# EAGLE design nixie-2-mirr (EAGLE 5.04)
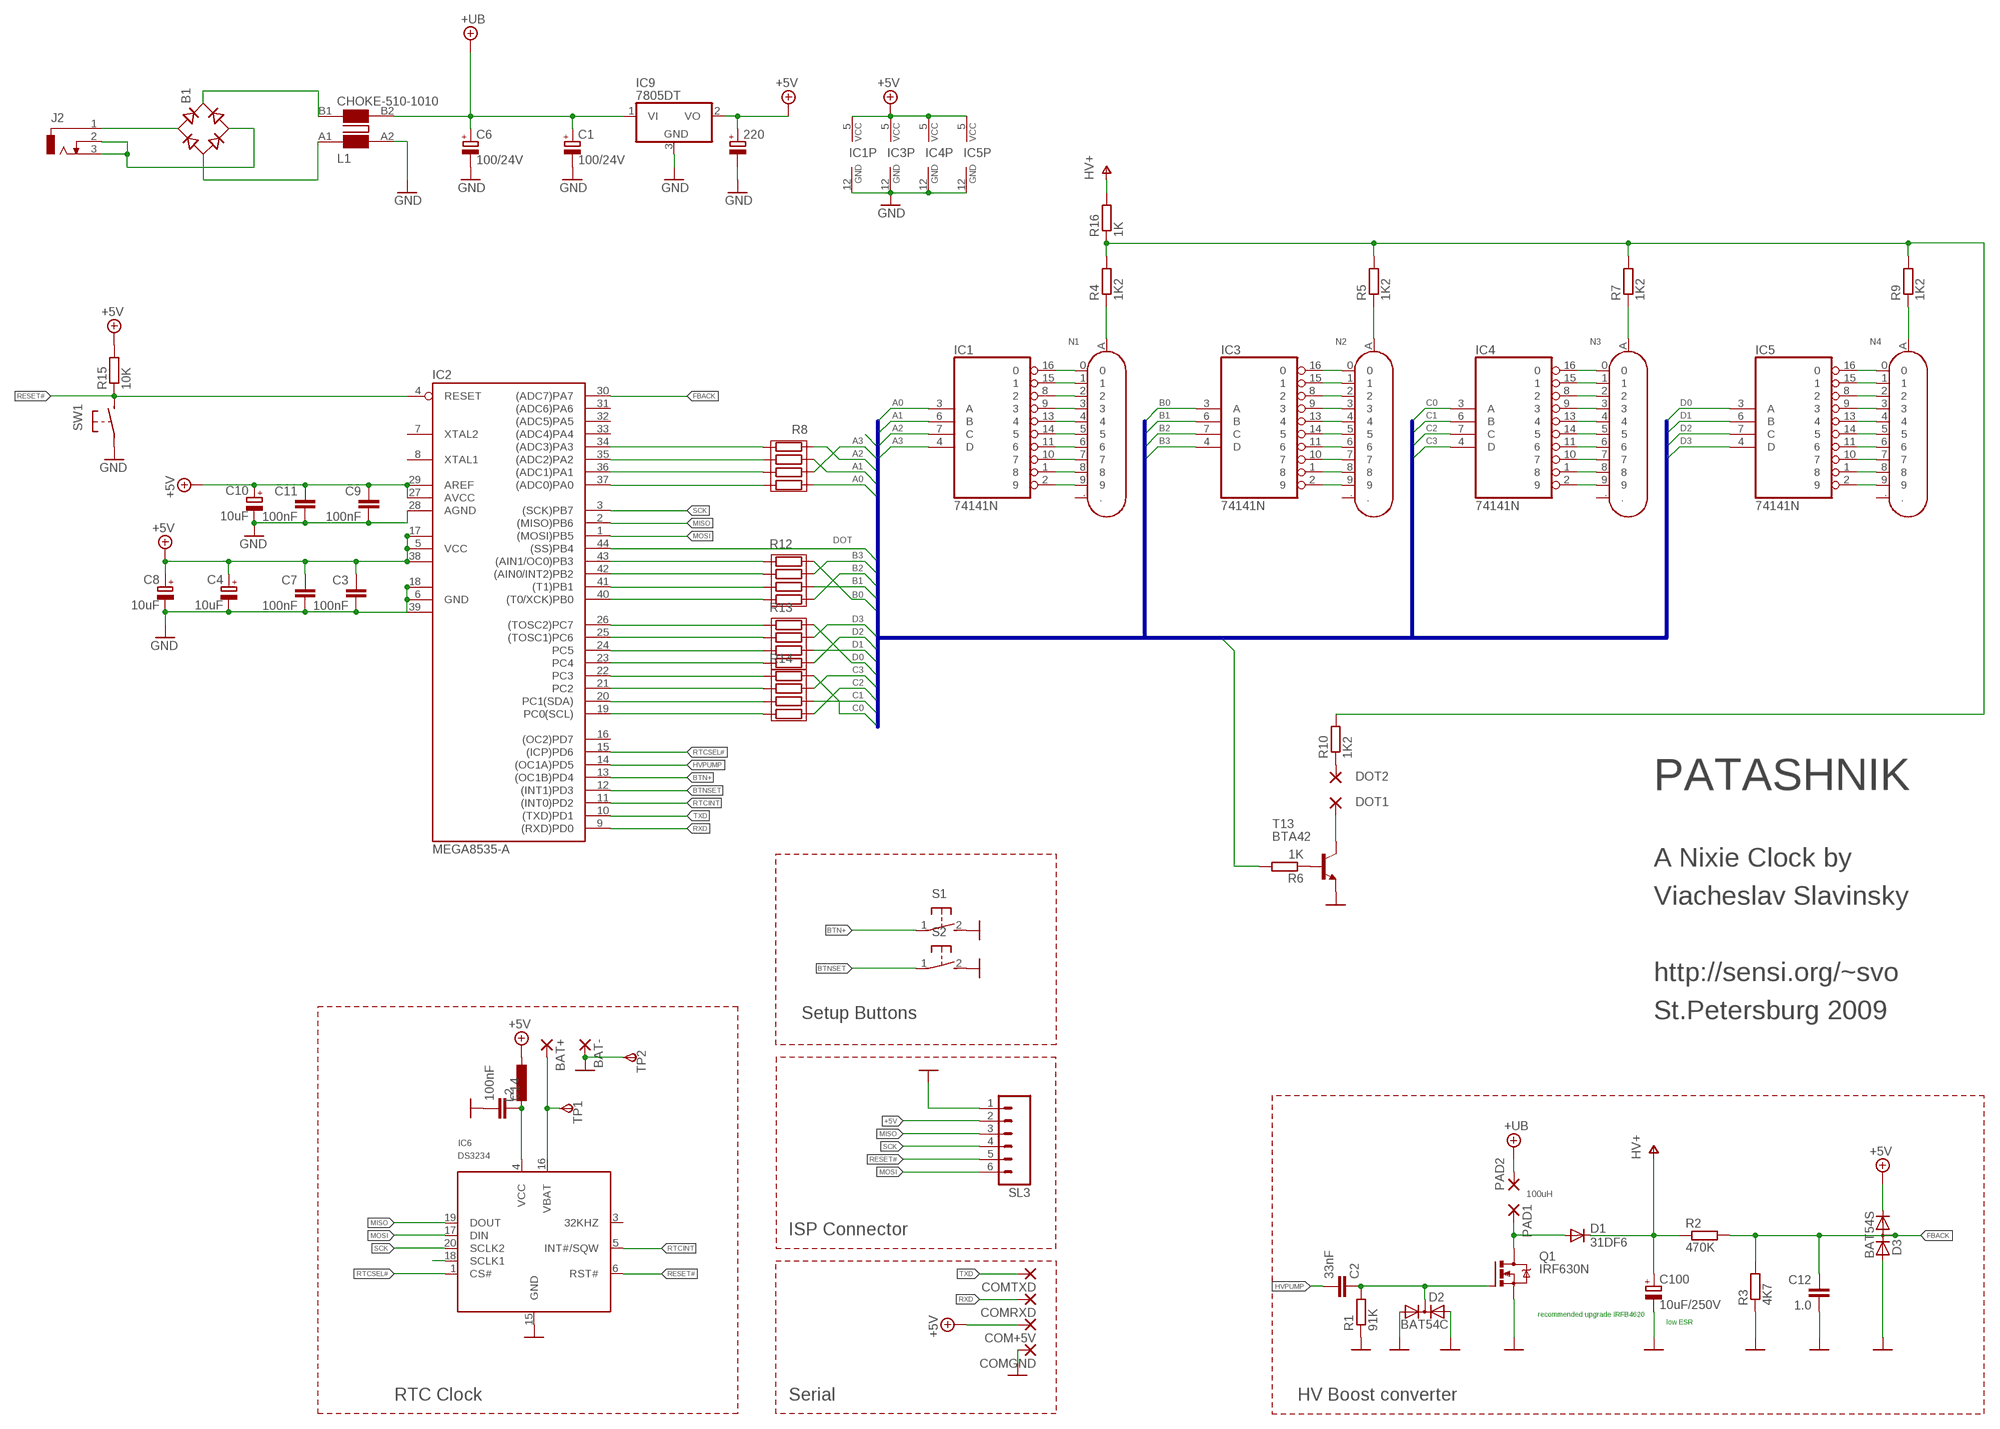
[diagram p0: schematic, sheet 1]

## Parts
220  CPOL-EUD/7343-31R  [D/7343-31R]
B1  B-DIL  [B-DIL]
BAT+  1,6/0,8  [1,6/0,8]
BAT-  1,6/0,8  [1,6/0,8]
C1  100/24V  CPOL-EUE3.5-8  [E3,5-8]
C2  33nF  C-EUC0805K  [C0805K]
C3  100nF  C-EUC0603K  [C0603K]
C4  10uF  CPOL-EUSMCB  [SMC_B]
C6  100/24V  CPOL-EUE3.5-8  [E3,5-8]
C7  100nF  C-EUC0603K  [C0603K]
C8  10uF  CPOL-EUSMCB  [SMC_B]
C9  100nF  C-EUC0603K  [C0603K]
C10  10uF  CPOL-EUSMCB  [SMC_B]
C11  100nF  C-EUC0603K  [C0603K]
C12  1.0  C-EUC0805S  [C0805S]
C14  100nF  C-EUC0603K  [C0603K]
C100  10uF/250V  CPOL-EUE5-13  [E5-13]
COM+5V  1,6/0,8  [1,6/0,8]
COMGND  1,6/0,8  [1,6/0,8]
COMRXD  1,6/0,8  [1,6/0,8]
COMTXD  1,6/0,8  [1,6/0,8]
D1  31DF6  RGP30  [DO201-15]
D2  BAT54C  DIODE-2AC|CASOT23  [SOT23]
D3  BAT54S  DIODE_2CACA-SOT23  [SOT23@1]
DOT1  1,6/0,8  [1,6/0,8]
DOT2  1,6/0,8  [1,6/0,8]
IC1  74141N  [DIL16]
IC2  MEGA8535-A  [TQFP44]
IC3  74141N  [DIL16]
IC4  74141N  [DIL16]
IC5  74141N  [DIL16]
IC6  DS3234  [SO-20DW]
IC9  7805DT  [TO252]
J2  DCJ-SMALL  [DCJ-SMALL]
L1  CHOKE-510-1010  [WE-SL2_74422...]
L2  L-EUL4532C  [L4532M]
N1  IN-8-2  [IN-8]
N2  IN-8-2  [IN-8]
N3  IN-8-2  [IN-8]
N4  IN-8-2  [IN-8]
PAD1  1,6/0,8  [1,6/0,8]
PAD2  1,6/0,8  [1,6/0,8]
Q1  IRF630N  IRF740  [TO220BV]
R1  91K  R-EU_R0805S  [R0805-SVO]
R2  470K  R-EU_R0805S  [R0805-SVO]
R3  4K7  R-EU_R0805S  [R0805-SVO]
R4  1K2  R-EU_R0805S  [R0805-SVO]
R5  1K2  R-EU_R0805S  [R0805-SVO]
R6  1K  R-EU_R0805S  [R0805-SVO]
R7  1K2  R-EU_R0805S  [R0805-SVO]
R8  RES4  [RESSMD-YC16]
R9  1K2  R-EU_R0805S  [R0805-SVO]
R10  1K2  R-EU_R0805S  [R0805-SVO]
R12  RES4  [RESSMD-YC16]
R13  RES4  [RESSMD-YC16]
R14  RES4  [RESSMD-YC16]
R15  10K  R-EU_R0805S  [R0805-SVO]
R16  1K  R-EU_R0805S  [R0805-SVO]
S1  31-XX  [B3F-31XX]
S2  31-XX  [B3F-31XX]
SL3  M06  [06P]
SW1  BUTTON-IT_1181  [SW_IT1181]
T13  BTA42  MMBTA42LT1-NPN-SOT23-BEC  [SOT23-BEC]
TP1  TPSTP20SQ  [TP20SQ]
TP2  TPSTP20SQ  [TP20SQ]

## Nets
+5V: 220.+ C3.1 C4.+ C7.1 C8.+ C9.1 C10.+ C11.1 COM+5V.1(P) D3.2(C) IC1.5(VCC) IC2.5(VCC) IC2.17(VCC1) IC2.27(AVCC) IC2.29(AREF) IC2.38(VCC2) IC3.5(VCC) IC4.5(VCC) IC5.5(VCC) IC9.2(VO) L2.1 R15.2 SL3.2
+UB: C1.+ C6.+ IC9.1(VI) L1.B2 PAD2.1(P)
A0: IC1.3(A) R8.R4$1(4.1)
A1: IC1.6(B) R8.R2$1(2.1)
A2: IC1.7(C) R8.R1$1(1.1)
A3: IC1.4(D) R8.R3$1(3.1)
AN1: N1.A R4.1
AN2: N2.A R5.1
AN3: N3.A R7.1
AN4: N4.A R9.1
B0: IC3.3(A) R12.R1$2(1.2)
B1: IC3.6(B) R12.R3$2(3.2)
B2: IC3.7(C) R12.R4$2(4.2)
B3: IC3.4(D) R12.R2$2(2.2)
BTN+: IC2.13((OC1B)PD4) S1.1(P)
BTNSET: IC2.12((INT1)PD3) S2.1(P)
C0: IC4.3(A) R14.R1$2(1.2)
C1: IC4.6(B) R14.R3$2(3.2)
C2: IC4.7(C) R14.R4$2(4.2)
C3: IC4.4(D) R14.R2$2(2.2)
D0: IC5.3(A) R13.R1$2(1.2)
D1: IC5.6(B) R13.R3$2(3.2)
D2: IC5.7(C) R13.R4$2(4.2)
D3: IC5.4(D) R13.R2$2(2.2)
DOT: IC2.44((SS)PB4) R6.2
FBACK: C12.1 D3.3(AC) IC2.30((ADC7)PA7) R2.2 R3.2
GND: 220.- BAT-.1(P) C1.- C3.2 C4.- C6.- C7.2 C8.- C9.2 C10.- C11.2 C12.2 C14.2 C100.- COMGND.1(P) D2.1(A1) D2.2(A2) D3.1(A) IC1.12(GND) IC2.6(GND) IC2.18(GND1) IC2.28(AGND) IC2.39(GND2) IC3.12(GND) IC4.12(GND) IC5.12(GND) IC6.15(GND) IC9.3(GND) L1.A2 Q1.S R1.1 R3.1 S1.2(S) S2.2(S) SL3.1 SW1.P$1(P1) T13.E TP2.TP(PP)
HV+: C100.+ D1.C R2.1 R16.2
HVBUS: R4.2 R5.2 R7.2 R9.2 R10.2 R16.1
HVPUMP: C2.2 IC2.14((OC1A)PD5)
MISO: IC2.2((MISO)PB6) IC6.19(DOUT) SL3.3
MOSI: IC2.1((MOSI)PB5) IC6.17(DIN) SL3.6
N$1: DOT2.1(P) R10.1
N$2: IC6.18(SCLK1)
N$3: C2.1 D2.3(C) Q1.G R1.2
N$4: IC1.16 N1.0
N$5: IC1.15 N1.1
N$6: IC1.8 N1.2
N$7: D1.A PAD1.1(P) Q1.D
N$8: IC1.9 N1.3
N$9: BAT+.1(P) IC6.16(VBAT) TP1.TP(PP)
N$11: IC1.13 N1.4
N$12: IC1.14 N1.5
N$13: IC1.11 N1.6
N$14: IC1.10 N1.7
N$15: IC1.1 N1.8
N$16: IC1.2 N1.9
N$17: IC3.16 N2.0
N$18: IC3.15 N2.1
N$19: IC3.8 N2.2
N$20: IC3.9 N2.3
N$21: R6.1 T13.B
N$22: IC3.13 N2.4
N$23: IC3.14 N2.5
N$24: IC3.11 N2.6
N$25: B1.+ L1.B1
N$26: IC3.10 N2.7
N$27: IC3.1 N2.8
N$28: IC3.2 N2.9
N$29: IC4.16 N3.0
N$30: IC4.15 N3.1
N$31: IC4.8 N3.2
N$32: IC4.9 N3.3
N$33: B1.- L1.A1
N$34: IC4.13 N3.4
N$35: IC4.14 N3.5
N$36: IC4.11 N3.6
N$37: IC4.10 N3.7
N$38: IC4.1 N3.8
N$39: IC4.2 N3.9
N$40: IC5.16 N4.0
N$41: IC5.15 N4.1
N$42: IC5.8 N4.2
N$44: IC5.9 N4.3
N$45: IC5.13 N4.4
N$46: IC5.14 N4.5
N$47: IC5.11 N4.6
N$48: IC5.10 N4.7
N$49: IC5.1 N4.8
N$50: IC5.2 N4.9
N$51: DOT1.1(P) T13.C
N$53: C14.1 IC6.4(VCC) L2.2
N$56: IC2.43((AIN1/OC0)PB3) R12.R1$1(1.1)
N$63: IC2.42((AIN0/INT2)PB2) R12.R2$1(2.1)
N$64: B1.AC2 J2.2 J2.3
N$65: B1.AC1 J2.1
N$66: IC2.41((T1)PB1) R12.R3$1(3.1)
N$67: IC2.40((T0/XCK)PB0) R12.R4$1(4.1)
N$68: IC2.26((TOSC2)PC7) R13.R1$1(1.1)
N$69: IC2.25((TOSC1)PC6) R13.R2$1(2.1)
N$70: IC2.24(PC5) R13.R3$1(3.1)
N$71: IC2.23(PC4) R13.R4$1(4.1)
N$72: IC2.22(PC3) R14.R1$1(1.1)
N$73: IC2.21(PC2) R14.R2$1(2.1)
N$74: IC2.20(PC1(SDA)) R14.R3$1(3.1)
N$75: IC2.19(PC0(SCL)) R14.R4$1(4.1)
N$76: IC2.34((ADC3)PA3) R8.R1$2(1.2)
N$77: IC2.35((ADC2)PA2) R8.R2$2(2.2)
N$78: IC2.36((ADC1)PA1) R8.R3$2(3.2)
N$79: IC2.37((ADC0)PA0) R8.R4$2(4.2)
RESET#: IC2.4(RESET) IC6.6(RST#) R15.1 SL3.5 SW1.P$2(P2)
RTCINT: IC2.11((INT0)PD2) IC6.5(INT#/SQW)
RTCSEL#: IC2.15((ICP)PD6) IC6.1(CS#)
RXD: COMRXD.1(P) IC2.9((RXD)PD0)
SCK: IC2.3((SCK)PB7) IC6.20(SCLK2) SL3.4
TXD: COMTXD.1(P) IC2.10((TXD)PD1)
Unconnected: IC2.7(XTAL2) IC2.8(XTAL1) IC2.16((OC2)PD7) IC2.31((ADC6)PA6) IC2.32((ADC5)PA5) IC2.33((ADC4)PA4) IC6.3(32KHZ) N1.. N2.. N3.. N4..

## Buses
A[0..3],B[0..3],C[0..3],D[0..3],DOT

## Notes on the sheet
- PATASHNIK
- A Nixie Clock by
- Viacheslav Slavinsky
- http://sensi.org/~svo
- Setup Buttons | St.Petersburg 2009
- 100uH
- ISP Connector
- recommended upgrade IRFB4620
- low ESR
- RTC Clock | Serial | HV Boost converter

## Library data of the parts
220 C1 C4 C6 C8 C10 C100 = rcl:CPOL-EU: POLARIZED CAPACITOR, European symbol
B1 = rectifier:B-DIL: RECTIFIER
BAT+ BAT- COM+5V COMGND COMRXD COMTXD DOT1 DOT2 PAD1 PAD2 = wirepad:1,6/0,8: THROUGH-HOLE PAD
C2 C3 C7 C9 C11 C12 C14 = rcl:C-EU: CAPACITOR, European symbol
D1 = diode:RGP30: DIODE fast-recovery rectifier
D2 = diode:DIODE-2AC|CA: Dual DIODE Anode-Cathode|Cathode-Anode
D3 = diode:DIODE_2CACA-: 2 Diodes - Cathode-Anode|Cathode-Anode
IC1 IC3-IC5 = 74xx-eu:74*141: BCD to decimal DECODER/DRIVER
IC2 = avr:MEGA8535: MICROCONTROLLER 8 Kbytes FLASH 512 bytes SRAM 512 bytes EEPROM USART 8-channel 10 bit ADC
IC6 = 0-ds3234:DS3234*: Extremely Accurate SPI Bus RTC with Integrated Crystal and SRAM The DS3234 is a low-cost, extremely accurate SPI? bus real-time clock (RTC) with an integrated temperature-com- pensated crystal oscillator (TCXO) and crystal. The DS3234 incorporates a precision, temperature-compen- sated voltage reference and comparator circuit to monitor VCC. When VCCdrops below the power-fail voltage (VPF), the device asserts the RSToutput and also disables read and write access to the part when VCCdrops below both VPFand VBAT. The RSTpin is monitored as a pushbutton input for generating a µP reset. The device switches to the backup supply input and maintains accurate timekeeping when main power to the device is interrupted. The integra- tion of the crystal resonator enhances the long-term accu- racy of the device as well as reduces the piece-part count in a manufacturing line. The DS3234 is available in com- mercial and industrial temperature ranges, and is offered in an industry-standard 300-mil, 20-pin SO package. The DS3234 also integrates 256 bytes of battery-backed SRAM. In the event of main power loss, the contents of the memory are maintained by the power source con- nected to the VBATpin. The RTC maintains seconds, minutes, hours, day, date, month, and year information. The date at the end of the month is automatically adjust- ed for months with fewer than 31 days, including correc- tions for leap year. The clock operates in either the 24-hour or 12-hour format with AM/PM indicator. Two programmable time-of-day alarms and a programmable square-wave output are provided. Address and data are transferred serially by an SPI bidirectional bus. Accuracy ±2ppm from 0°C to +40°C Accuracy ±3.5ppm from -40°C to +85°C Battery Backup Input for Continuous Timekeeping Operating Temperature Ranges Commercial: 0°C to +70°C Industrial: -40°C to +85°C Low-Power Consumption Real-Time Clock Counts Seconds, Minutes, Hours, Day, Date, Month, and Year with Leap Year Compensation Valid Up to 2099 Two Time-of-Day Alarms Programmable Square-Wave Output 4MHz SPI Bus Supports Modes 1 and 3 Digital Temp Sensor Output: ±3°C Accuracy Register for Aging Trim RSTInput/Output 300-Mil, 20-Pin SO Package Underwriters Laboratories (UL®) Recognized
IC9 = linear:78*: Positive VOLTAGE REGULATOR Source: http://cache.national.com/ds/LM/LM78L05.pdf http://www.fairchildsemi.com/ds/LM/LM7805.pdf
J2 = 0-svo:DCJ-SMALL: Smaller DC power jack
L1 = 0-svo:CHOKE-510-1010
L2 = rcl:L-EU: INDUCTOR, European symbol
N1-N4 = 0-nixies-russian:IN-8-2: IN-8-2 Nixie Tube
Q1 = transistor-power:IRF740: N-CHANNEL MOS FET
R1-R7 R9 R10 R15 R16 = rcl:R-EU_: RESISTOR, European symbol
R8 R12-R14 = 0-svo:RES4
S1 S2 = switch-omron:31-XX: OMRON SWITCH
SL3 = con-amp-quick:M06: AMP QUICK CONNECTOR
SW1 = 0-svo:BUTTON-IT_1181
T13 = transistor:*-NPN-: NPN Transistror
TP1 TP2 = 0-svo:TPS: TEST PIN

## Board
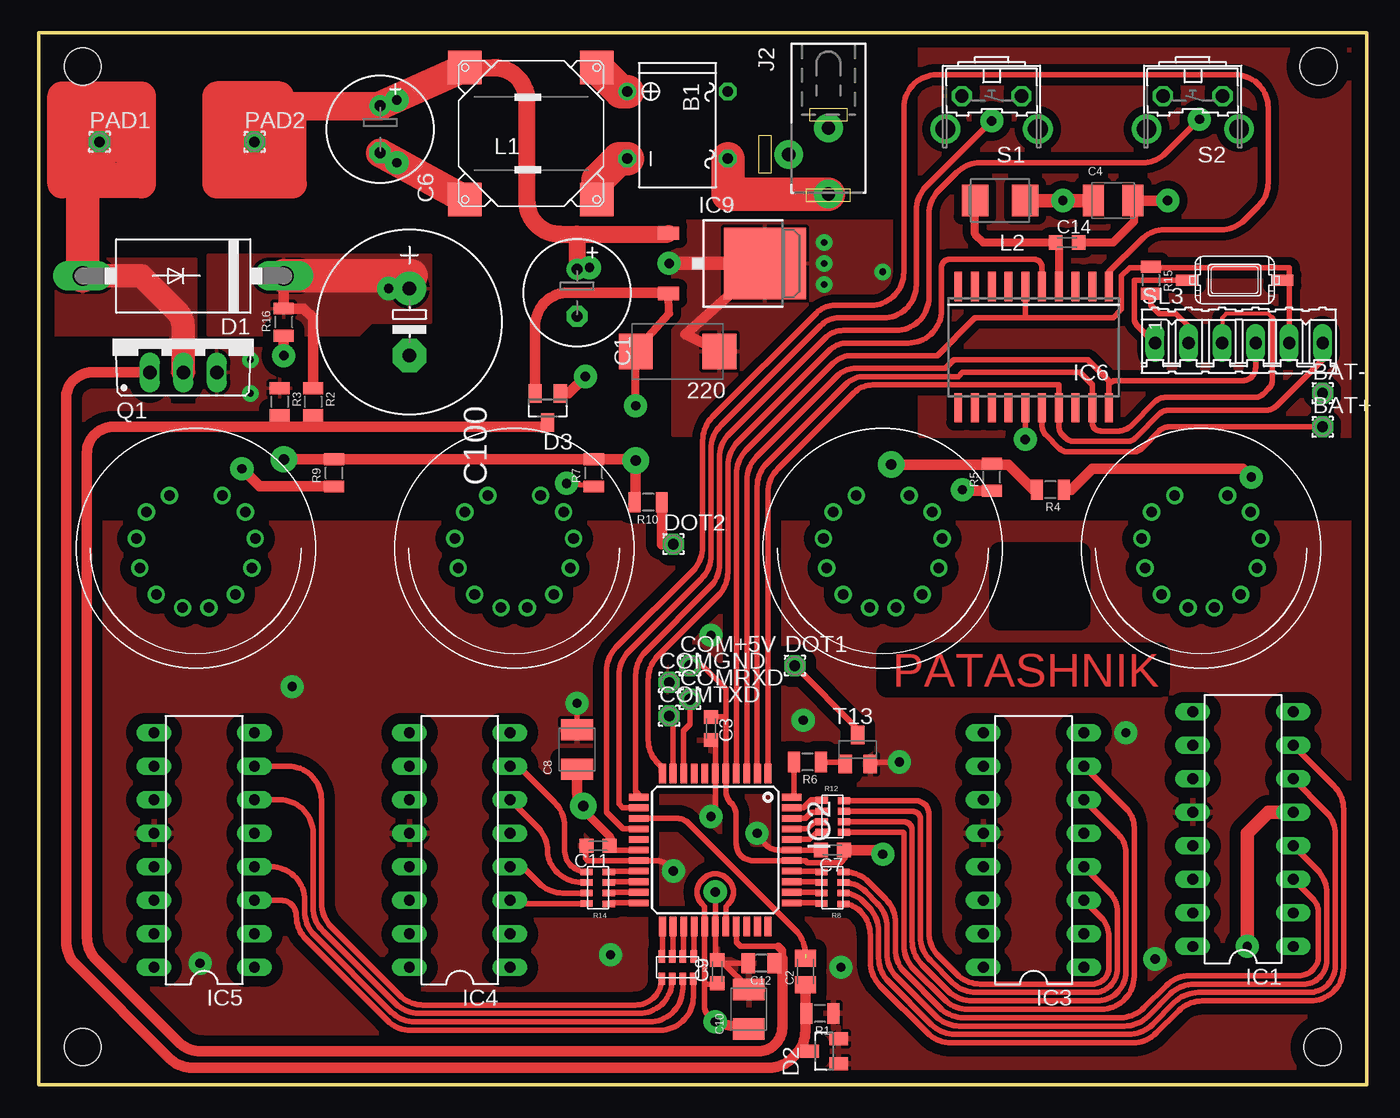
[diagram p1: board, top side]
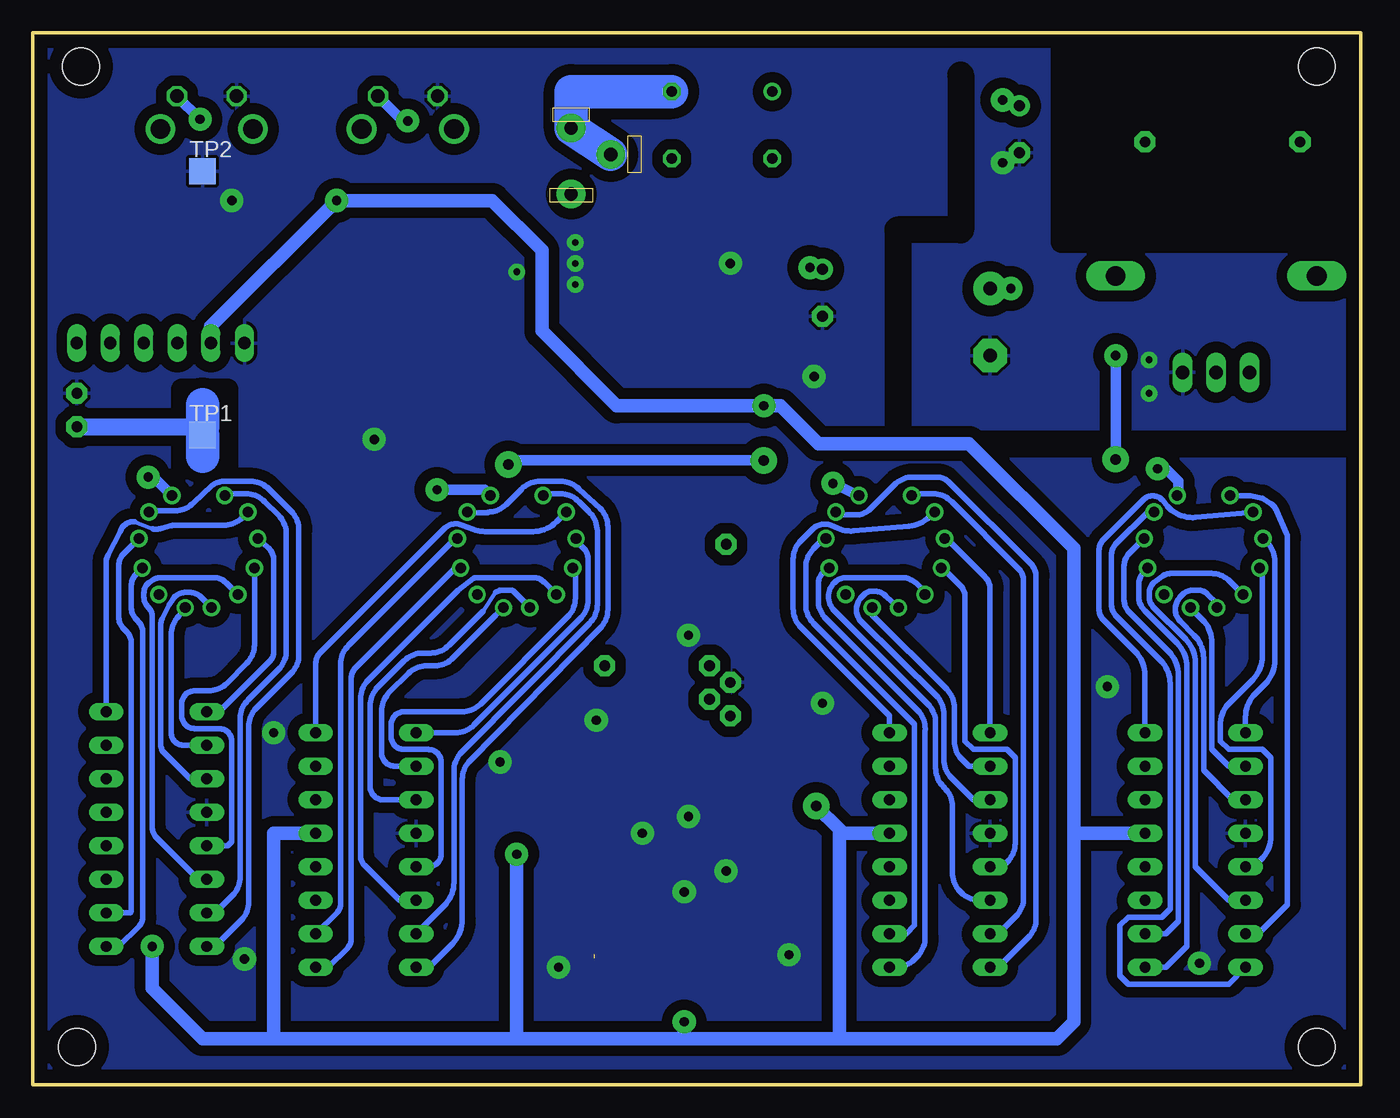
[diagram p2: board, bottom side, seen from below]

Size 100.64 x 79.68 mm. Coordinates in mm from the lower left corner, seen from the top.
Outline: 0,0 100.64,0 100.64,79.68 0,79.68 0,0
Copper layers (1*16): Top 0.035mm / dielectric 1.5mm / Bottom 0.035mm
Design rules "default": minimum track width 10mil, minimum drill 24mil, track to track 10mil, track to pad 10mil, pad to pad 8mil, via to via 8mil, smd to smd 8mil, copper to edge 40mil, drill to drill 8mil, minimum pad ring 10mil, minimum via ring 8mil, stop-mask expansion 4mil, vias tented up to drill 0mil, thermal gap 10mil
Holes 2.8 mm at 3.33,2.85 3.33,77.15 96.99,77.15 97.31,2.85
tRestrict: area 5.6,65.1 to 18.6,78.1; area 72.9,35.2 to 78.9,40.3; area 64.3,30.2 to 84.6,32.7
bRestrict: area 0.2,63.8 to 22.7,79.4; area 85.9,46.7 to 89.4,52.7; 4 lines

### Footprints (pad centres in the part's own frame; a part is rotated, then mirrored left to right if it is on the bottom)
D/7343-31R = smd 2.55 x 2.7: + 3.175,0; - -3.175,0
B-DIL = drill 0.813 round: + -2.54,-3.81 | drill 0.813 octagon: - 2.54,-3.81; AC1 2.54,3.81; AC2 -2.54,3.81
1,6/0,8 = drill 0.813 pad 1.6 octagon: 1 0,0
E3,5-8 = drill 0.813 pad 1.6 round: + -1.778,0 | drill 0.813 pad 1.6 octagon: - 1.778,0
C0805K = smd 1.3 x 1.6: 1 -1,0; 2 1,0
C0603K = smd 1.05 x 1.08: 1 -0.875,0; 2 0.875,0
SMC_B = smd 1.6 x 2.4: + -1.5,0; - 1.5,0
C0805S = smd 1.016 x 1.524: 1 -0.977,0; 2 0.977,0
E5-13 = drill 1.016 pad 2.54 round: + -2.54,0 | drill 1.016 pad 2.54 octagon: - 2.54,0
DO201-15 = drill 1.499 long: A 7.62,0; C -7.62,0
SOT23 = smd 1 x 1.4: 1 -0.95,-1.1; 2 0.95,-1.1; 3 0,1.1
SOT23@1 = smd 1 x 1.4: 1 -0.95,-1.1; 2 0.95,-1.1; 3 0,1.1
DIL16 = drill 0.813 long: 1 -8.89,-3.81; 2 -6.35,-3.81; 3 -3.81,-3.81; 4 -1.27,-3.81; 5 1.27,-3.81; 6 3.81,-3.81; 7 6.35,-3.81; 8 8.89,-3.81; 9 8.89,3.81; 10 6.35,3.81; 11 3.81,3.81; 12 1.27,3.81; 13 -1.27,3.81; 14 -3.81,3.81; 15 -6.35,3.81; 16 -8.89,3.81
TQFP44 = smd 1.5 x 0.5: 1 -5.8,4; 2 -5.8,3.2; 3 -5.8,2.4; 4 -5.8,1.6; 5 -5.8,0.8; 6 -5.8,0; 7 -5.8,-0.8; 8 -5.8,-1.6; 9 -5.8,-2.4; 10 -5.8,-3.2; 11 -5.8,-4; 23 5.8,-4; 24 5.8,-3.2; 25 5.8,-2.4; 26 5.8,-1.6; 27 5.8,-0.8; 28 5.8,0; 29 5.8,0.8; 30 5.8,1.6; 31 5.8,2.4; 32 5.8,3.2; 33 5.8,4 | smd 0.5 x 1.5: 12 -4,-5.8; 13 -3.2,-5.8; 14 -2.4,-5.8; 15 -1.6,-5.8; 16 -0.8,-5.8; 17 0,-5.8; 18 0.8,-5.8; 19 1.6,-5.8; 20 2.4,-5.8; 21 3.2,-5.8; 22 4,-5.8; 34 4,5.8; 35 3.2,5.8; 36 2.4,5.8; 37 1.6,5.8; 38 0.8,5.8; 39 0,5.8; 40 -0.8,5.8; 41 -1.6,5.8; 42 -2.4,5.8; 43 -3.2,5.8; 44 -4,5.8
SO-20DW = smd 0.6 x 2.2: 1 -5.715,-4.6; 2 -4.445,-4.6; 3 -3.175,-4.6; 4 -1.905,-4.6; 5 -0.635,-4.6; 6 0.635,-4.6; 7 1.905,-4.6; 8 3.175,-4.6; 9 4.445,-4.6; 10 5.715,-4.6; 11 5.715,4.6; 12 4.445,4.6; 13 3.175,4.6; 14 1.905,4.6; 15 0.635,4.6; 16 -0.635,4.6; 17 -1.905,4.6; 18 -3.175,4.6; 19 -4.445,4.6; 20 -5.715,4.6
TO252 = smd 1 x 1.6: 1 -2.28,-4.8; 2 2.28,-4.8 | smd 5.4 x 6.2: 3 0,2.5
DCJ-SMALL = drill 1 pad 2.184 round: 1 0,3; 2 3,0; 3 0,-2
WE-SL2_74422... = smd 2.54 x 2.54: A1 -5,5; A2 5,5; B1 -5,-5; B2 5,-5
L4532M = smd 2 x 2.4: 1 -1.9,0; 2 1.9,0
IN-8 = drill 0.8 round: 0 -3.75,-2.75; 1 2,-4; 2 3.75,-2.75; 3 4.5,-0.75; 4 4.25,1.5; 5 3,3.5; 6 1,4.5; 7 -1,4.5; 8 -4.25,1.5; 9 -4.5,-0.75; . -3,3.5; A -2,-4
TO220BV = drill 1.016 long: D 0,-2.54; G -2.54,-2.54; S 2.54,-2.54
R0805-SVO = smd 0.9 x 1.524: 1 -1.027,0; 2 1.027,0
RESSMD-YC16 = smd 0.508 x 0.914: R1$1 -1.23,-0.821; R1$2 -1.2,0.851; R2$1 -0.4,-0.821; R2$2 -0.4,0.851; R3$1 0.4,-0.821; R3$2 0.4,0.851; R4$1 1.2,-0.821; R4$2 1.2,0.851
B3F-31XX = drill 1.016 octagon: 1 -2.261,-1.245; 2 2.261,-1.245 | drill 1.499 pad 2.159 round: 3 -3.505,1.245; 4 3.505,1.245
06P = drill 0.914 long: 1 -6.35,0; 2 -3.81,0; 3 -1.27,0; 4 1.27,0; 5 3.81,0; 6 6.35,0
SW_IT1181 = smd 1.676 x 0.813: P$1 -3.61,0; P$2 3.61,0
SOT23-BEC = smd 1 x 1.4: B -0.95,-1.1; C 0,1.1; E 0.95,-1.1
TP20SQ = smd 2 x 2: TP 0,0

### Placement (x,y rotation side)
220  48.41,55.56 180 top
B1  48.41,72.7 270 top
BAT+  97.31,49.84 0 top
BAT-  97.31,52.38 0 top
C1  40.79,60 270 top
C2  58.1,8.57 90 top
C3  50.95,26.98 270 top
C4  81.43,66.99 0 top
C6  25.87,72.39 270 top
C7  60.16,17.78 180 top
C8  40.79,25.39 90 top
C9  51.43,8.57 90 top
C10  53.81,5.71 90 top
C11  42.38,18.09 180 top
C12  54.76,9.2 180 top
C14  77.94,63.81 0 top
C100  28.09,57.78 270 top
COM+5V  49.37,31.75 0 top
COMGND  47.78,30.48 0 top
COMRXD  49.37,29.21 0 top
COMTXD  47.78,27.94 0 top
D1  10.95,61.27 180 top
D2  59.52,2.54 90 top
D3  38.57,51.27 180 top
DOT1  57.3,31.75 0 top
DOT2  48.09,40.95 0 top
IC1  91.28,19.36 90 top
IC2  51.27,17.78 270 top
IC3  75.4,17.78 90 top
IC4  31.9,17.78 90 top
IC5  12.54,17.78 90 top
IC6  75.4,55.88 180 top
IC9  52.54,62.23 270 top
J2  59.84,70.48 180 top
L1  37.3,72.07 180 top
L2  72.86,66.99 180 top
N1  88.1,40.63 180 top
N2  63.97,40.63 180 top
N3  36.03,40.63 180 top
N4  11.9,40.63 180 top
PAD1  4.6,71.43 0 top
PAD2  16.34,71.43 0 top
Q1  10.95,56.51 0 top
R1  59.21,5.39 180 top
R2  20.79,51.75 270 top
R3  18.25,51.75 270 top
R4  76.67,45.08 180 top
R5  72.22,46.03 90 top
R6  58.25,24.44 180 top
R7  42.06,46.35 90 top
R8  60.16,14.92 90 top
R9  22.38,46.35 90 top
R10  46.19,44.13 180 top
R12  60.16,20.32 270 top
R13  48.41,8.88 180 top
R14  42.38,14.92 90 top
R15  84.29,60.95 270 top
R16  18.57,57.78 90 top
S1  72.22,73.66 180 top
S2  87.47,73.66 180 top
SL3  90.96,56.19 0 top
SW1  90.64,60.95 0 top
T13  62.06,25.39 0 top
TP1  87.78,49.21 0 bottom
TP2  87.78,69.21 0 bottom

### Tracks (layer width: path | path; a pad name or v marks a point on that pad's centre or on a via)
+5V  (via drill 0.7, 0.8)
  Top 0.406: R15.2 84.29,59.05 84.92,58.41 86.19,58.41 87.15,57.46 SL3.2 | 51.35,7.69 C9.1 51.35,7.61 50.63,7.61 50.47,7.77 | 52.07,27.94 IC2.5 52.07,22.26 arc45 52.44,21.37 52.49,21.32 arc-45 52.86,20.42 52.86,18.25 arc90 54.13,16.98 IC2.38 | 52.07,27.94 52.07,29.99 50.32,31.75 COM+5V.1 | C3.1 51.99,27.86 52.07,27.94 | IC2.38 | 50.47,7.77 IC2.27 50.47,13.5 50.26,13.7 arc-90 50.26,15.5 50.37,15.61 arc-90 52.17,15.61 52.28,15.5 arc-90 52.28,13.7 52.07,13.5 IC2.29 | IC2.38 58.1,16.98 58.25,16.82 60.8,16.82 61.11,17.14 61.11,17.7 C7.1 | 51.34,4.69 v51.27,4.76 50.66,5.37 arc-45 50.47,5.82 50.47,7.77 | IC2.17 43.57,17.78 C11.1 | v41.27,21.11
  Top 0.61: v45.24,51.43 220.+ 47.78,58.41 IC9.2 | v41.27,21.11 41.27,20.79 43.33,18.73 43.33,18.17 C11.1
  Top 0.813: v41.27,21.11 arc-45 40.79,22.26 C8.+ | 51.34,4.69 C10.+ | IC9.2 47.68,60 40.12,60 arc90 37.62,57.5 D3.2 | C7.1 63.97,17.78 v63.97,17.46
  Top 1.016: v91.59,10.47 91.59,19.05 93.18,20.63 IC1.5 | C4.+ v77.62,66.99 L2.1
  Bottom 0.406: 39.52,19.36
  Bottom 1.016: 39.52,19.05 IC4.5 | 39.52,3.49 39.52,19.05 | v91.59,10.47 91.59,7.3 87.78,3.49 82.39,3.49 | 21.74,19.05 IC5.5 | 39.52,3.49 23.01,3.49 21.74,4.76 21.74,19.05 | 21.74,19.05 21.74,40.63 29.68,48.57 41.11,48.57 43.97,51.43 v45.24,51.43 56.39,51.43 62.06,57.11 62.06,63.22 65.83,66.99 v77.62,66.99 87.15,57.46 SL3.2 | 39.52,19.05 39.52,19.36 v41.27,21.11 | 63.97,3.49 v63.97,17.46 | 63.97,3.49 82.39,3.49 | 82.39,3.49 82.39,19.05 IC3.5 | 39.52,3.49 51.27,3.49 | 51.27,3.49 v51.27,4.76 | 51.27,3.49 63.97,3.49
+UB  (via drill 0.7)
  Top 0.61: C6.+ v27.14,74.61
  Top 0.8: C1.+ v41.74,61.91
  Top 0.813: C6.+ 26.19,74.61
  Top 1.27: L1.B2 34.48,77.07 arc-90 36.98,74.57 36.98,66.95 arc90 39.48,64.45 40.79,64.45 | 40.79,64.45 47.68,64.45 IC9.1 | 18.25,69.21 15.08,69.21 15.08,73.97 16.34,74.29 | 40.79,64.45 C1.+
  Top 2.184: 18.25,69.21 18.25,74.92 13.49,74.92 13.49,68.26 19.2,68.26 19.2,74.13 C6.+ L1.B2 | 16.34,74.29 PAD2.1 16.34,69.53
A0
  Top 0.406: R8.R4$1 61.08,16.12 arc-45 62.88,15.37 64.18,14.07 arc-45 64.92,12.28 64.92,10.26 arc45 65.67,8.46 68.31,5.82 arc45 70.1,5.08 81.97,5.08 arc45 83.76,5.82 85.45,7.51 arc-45 87.25,8.25 95.49,8.25 arc90 96.99,9.75 96.99,13.03 arc45 96.55,14.09 IC1.3
A1
  Top 0.406: R8.R2$1 arc-45 62.43,13.92 62.91,13.44 arc-45 63.65,11.64 63.65,9.62 arc45 64.4,7.82 67.67,4.55 arc45 69.47,3.8 82.6,3.8 arc45 84.4,4.55 86.09,6.24 arc-45 87.88,6.98 96.26,6.98 arc90 98.26,8.98 98.26,18.96 arc45 97.53,20.73 IC1.6
A2
  Top 0.406: R8.R1$1 arc-45 62.22,13.17 62.27,13.12 arc-45 63.02,11.33 63.02,9.3 arc45 63.76,7.51 67.35,3.91 arc45 69.15,3.17 82.92,3.17 arc45 84.72,3.91 86.4,5.6 arc-45 88.2,6.34 96.36,6.34 arc90 98.89,8.88 98.89,20.87 arc45 98.16,22.64 IC1.7
A3
  Top 0.406: R8.R3$1 arc-45 62.69,14.61 63.54,13.76 arc-45 64.29,11.96 64.29,9.94 arc45 65.03,8.14 67.99,5.18 arc45 69.78,4.44 82.28,4.44 arc45 84.08,5.18 85.77,6.87 arc-45 87.56,7.61 95.83,7.61 arc90 97.62,9.42 97.62,14.52 arc45 96.89,16.29 IC1.4
AN1  (via drill 0.7)
  Top 0.8: R4.1 78.26,45.08 79.84,46.67 91.28,46.67 v91.91,46.03
  Bottom 0.8: v91.91,46.03 91.5,46.03 N1.A
AN2  (via drill 0.7)
  Top 0.8: R5.1 70.08,45.01 v70,45.08
  Bottom 0.8: v70,45.08 66.41,45.08 N2.A
AN3  (via drill 0.7)
  Top 0.406: v40,45.56 R7.1
  Bottom 0.8: N3.A v40,45.56
AN4  (via drill 0.7)
  Top 0.8: R9.1 16.74,45.32 v15.39,46.67
  Bottom 0.8: v15.39,46.67 14.76,46.67 13.81,45.72 13.81,44.73 N4.A
B0
  Top 0.406: R12.R1$2 66.46,21.52 arc-90 67.46,20.52 67.46,11.53 arc45 68.21,9.73 69.58,8.36 arc45 71.37,7.61 79.84,7.61 arc90 81.11,8.88 81.11,11.23 arc45 80.53,12.65 IC3.3
B1
  Top 0.406: R12.R3$2 65.56,19.91 arc-90 66.19,19.28 66.19,10.89 arc45 66.94,9.09 68.94,7.09 arc45 70.74,6.34 80.19,6.34 arc90 82.39,8.54 82.39,17.58 arc45 81.8,19 IC3.6
B2
  Top 0.406: R12.R4$2 65.49,19.12 65.56,19.05 65.56,10.57 arc45 66.3,8.78 68.62,6.45 arc45 70.42,5.71 80.52,5.71 arc90 83.02,8.21 83.02,19.49 arc45 82.43,20.9 IC3.7
B3
  Top 0.406: R12.R2$2 66.19,20.71 arc-90 66.83,20.08 66.83,11.21 arc45 67.57,9.41 69.26,7.72 arc45 71.05,6.98 79.95,6.98 arc90 81.75,8.78 81.75,13.14 arc45 81.16,14.55 IC3.4
BTN+  (via drill 0.7)
  Top 0.406: IC2.13 44.26,20.98 43.97,21.27 43.97,31.01 arc-45 44.71,32.81 50.21,38.3 arc45 50.95,40.1 50.95,48.16 arc-45 51.7,49.95 59.26,57.51 arc-45 60.67,58.1 64.01,58.1 arc90 66.51,60.6 66.51,66.27 arc-45 67.24,68.04 v72.22,73.02
  Bottom 0.8: v72.22,73.02 72.61,73.02 S1.1
BTNSET  (via drill 0.7)
  Top 0.406: IC2.12 45.47,21.99 45.24,22.22 45.24,31.01 arc-45 45.98,32.81 50.84,37.67 arc45 51.59,39.47 51.59,47.52 arc-45 52.33,49.32 59.57,56.56 arc-45 60.99,57.15 64.96,57.15 arc90 67.46,59.65 67.46,65.95 arc-45 68.19,67.72 69.59,69.11 arc-45 71.36,69.84 83.64,69.84 arc45 85.4,70.58 v87.97,73.15
  Bottom 0.8: v87.97,73.15 S2.1
C0
  Top 0.406: R14.R1$2 35.96,13.72 IC4.3
C1
  Top 0.406: R14.R3$2 41.13,15.32 arc-45 39.33,16.06 39.17,16.22 arc-45 38.57,17.68 arc45 37.83,19.47 IC4.6
C2
  Top 0.406: R14.R4$2 arc-90 39.84,17.81 39.84,19.58 arc45 39.1,21.38 36.35,24.12 IC4.7
C3
  Top 0.406: R14.R2$2 39.7,14.52 arc-45 37.91,15.26 36.66,16.5 IC4.4
D0
  Top 0.406: IC5.3 18.35,13.96 arc-90 19.52,12.79 arc45 20.26,11 26.4,4.87 arc45 28.19,4.12 47.07,4.12 arc90 49.61,6.66 R13.R1$2
D1
  Top 0.406: R13.R3$2 48.01,7.93 arc-90 45.47,5.39 28.83,5.39 arc-45 27.03,6.14 21.53,11.63 arc-45 20.79,13.43 20.79,19.05 arc90 18.25,21.59 IC5.6
D2
  Top 0.406: IC5.7 18.88,24.12 arc-90 21.42,21.59 21.42,13.75 arc45 22.17,11.95 27.35,6.77 arc45 29.14,6.03 45.21,6.03 arc90 R13.R4$2
D3
  Top 0.406: R13.R2$2 48.81,7.3 arc-90 46.27,4.76 28.51,4.76 arc-45 26.71,5.5 20.9,11.32 arc-45 20.15,13.11 20.15,13.96 arc90 17.61,16.5 IC5.4
DOT
  Top 0.406: R6.2 57.23,21.93 IC2.44
FBACK
  Top 0.406: IC2.30 52.87,10.78 53.17,10.47 56.03,10.47 | C12.1 56.03,9.2 56.35,9.52
  Top 0.61: 56.03,10.47 56.35,10.16 56.35,9.52
  Top 0.8: 20.79,49.84 R2.2 | R3.2 18.25,50.16 17.93,49.84 | 28.73,49.84 38.09,49.84 38.17,49.77
  Top 0.813: 56.35,9.52 56.35,4.33 arc-90 54.55,2.54 12.3,2.54 arc-45 10.53,3.27 4.38,9.42 arc-45 3.64,11.19 3.64,47.84 arc-90 5.64,49.84 17.93,49.84 20.79,49.84 28.73,49.84 | 38.17,49.77 D3.3
GND  (via drill 0.5, 0.7)
  Top 0.406: SW1.P$1 83.02,60.95 83.02,58.04 arc45 83.21,57.59 SL3.1 | C7.2 IC2.39 56.03,17.78 arc-53 55.02,18.28 v54.45,19.05 | 41.43,17.7 C11.2 41.43,18.02 41.43,17.14 41.59,16.98 IC2.18 46.78,16.98 arc-45 47.68,16.6 v48.09,16.19 | v51.27,14.6 IC2.28 51.27,9.6 C9.2 51.67,9.2 51.91,9.2 | v65.24,24.44 63.16,24.44 T13.E | C3.2 51.27,25.79 IC2.6 51.27,20.63 v50.95,20.32 | C8.- v40.79,28.89 | v74.77,48.89 IC6.15 | C12.2 51.91,9.2 | C10.- 53.81,7.3 51.91,9.2 | 83.02,66.9 C4.-
  Top 0.61: C14.2 81.43,63.81 83.02,65.4 83.02,66.9
  Top 0.8: D3.1 40.15,52.37 v41.43,53.65
  Top 0.813: IC9.3 49.01,56.87 220.- | C4.- v85.56,66.99
  Top 1.016: IC9.3 v47.78,62.23
  Top 2.184: L1.A2 C6.-
  other vias: 27.14,69.84 59.52,63.81 59.52,60.64 59.52,62.23 63.97,61.59 16.03,54.92 16.03,52.38 19.2,30.16 43.33,9.84 60.8,8.88 57.94,27.62 50.95,34.05 82.39,26.66 84.61,9.52 12.22,9.2
  pour Bottom (isolate 0.813, rank 2): -0.8,80.32 -0.8,-0.01 100.8,-0.01 100.8,80.32
  pour Top (isolate 0.61): 48.09,65.4 65.24,65.4 65.24,58.41 50,49.21 48.09,49.21
  pour Top (isolate 0.813, rank 2): 1.1,61.27 1.1,49.84 21.42,49.84 21.42,61.27
  pour Top (isolate 0.813, rank 2): -0.17,42.54 100.48,42.54 100.48,-0.64 -0.17,-0.64
HV+  (via drill 0.7)
  Top 0.8: R16.2 20.08,58.81 20.79,58.1 R2.1
  Top 0.813: R16.2 D1.C
  Top 1.422: 28.2,61.27 28.41,61.06 28.41,60.64 C100.+ v26.5,60.32
  Top 2.54: D1.C 28.2,61.27
  pour Top (isolate 0.813): 12.85,62.54 12.85,56.83 24.28,56.83 25.23,57.78 29.68,57.78 29.68,62.86 12.85,62.86
HVBUS  (via drill 0.7, 0.8)
  Top 0.254: 23.01,47.38 R9.2
  Top 0.8: 70.25,46.98 72.15,46.98 R5.2 72.3,46.98 73.5,46.98 75.4,45.08 R4.2
  Top 0.813: v18.57,55.24 R16.1 | v18.57,47.38 23.01,47.38 R7.2 45.87,47.38 45.87,47.3 v45.24,47.3 45.24,44.13 R10.2 | v64.61,46.98 70.25,46.98
  Bottom 0.61: 64.29,47.3 v64.61,46.98
  Bottom 0.813: v18.57,47.38 v18.57,55.24 | v45.24,47.3 64.29,47.3
HVPUMP  (1 unrouted)
  Top 0.406: IC2.14 48.34,20.18 arc-45 49.24,19.8 57.35,11.69 arc-45 58.1,9.9
MISO
  Top 0.305: SL3.3 89.69,58.1 90,58.41 93.18,58.41 93.5,58.1
  Top 0.406: IC2.2 54.45,23.6 54.45,45.3 arc-45 55.19,47.09 61.16,53.07 arc-45 62.58,53.65 69.69,53.65 70,53.97 78.89,53.97 79.84,53.02 IC6.19 79.84,50.16 arc90 80.48,49.52 81.86,49.52 arc45 82.76,49.9 84.63,51.77 arc-45 85.34,52.06 92.13,52.06 arc45 92.84,52.36 93.2,52.73 arc45 93.5,53.43 93.5,58.1
MOSI
  Top 0.305: 97.31,54.92 SL3.6
  Top 0.406: 97.31,54.92 93.79,51.41 arc-45 93.08,51.11 85.66,51.11 arc45 84.95,50.82 83.15,49.02 arc-45 82.45,48.73 78.51,48.73 arc-45 77.81,49.02 77.6,49.23 arc-45 77.3,49.94 IC6.17 77.3,53.02 63.21,53.02 arc45 61.8,52.43 56.01,46.65 arc45 55.27,44.85 IC2.1
N$1
  Top 0.813: DOT2.1 47.22,40.95 R10.1
N$3
  Top 0.8: 4.06,53.97 Q1.G | 58.1,4.05 58.1,5.08 | 58.1,5.08 C2.1 | R1.2 58.18,5.16 58.1,5.08 | D2.3 57.62,2.54 57.36,2.28
  Top 0.813: 4.06,53.97 arc90 2.06,51.97 2.06,10.87 arc45 2.79,9.11 9.9,2 arc45 11.67,1.26 55.31,1.26 arc45 57.08,2 57.36,2.28 arc45 58.1,4.05
N$4
  Bottom 0.406: IC1.16 86.83,10.47 84.88,12.43 arc-45 84.29,13.84 84.29,27.11 arc45 83.7,28.52 81.07,31.16 arc-45 80.48,32.57 80.48,42.03 arc-45 81.07,43.44 82.75,45.13 arc-45 84.17,45.72 85.84,45.72 arc-45 87.1,45.37 88.47,44.08 arc45 89.88,43.49 91.74,43.49 N1.0
N$5
  Bottom 0.406: N1.1 85.97,44.76 84.48,44.76 arc45 83.07,44.18 82.02,43.13 arc45 81.43,41.71 81.43,32.89 arc45 82.02,31.48 84.34,29.16 arc-45 84.92,27.74 84.92,15.75 arc45 85.51,14.33 86.83,13.01 IC1.15
N$6
  Bottom 0.305: 92.94,42.65 91.56,42.12
  Bottom 0.406: N1.2 84.77,42.97 arc45 86.18,42.38 89.88,42.38 arc-14 90.2,42.34 90.9,42.16 arc34 91.56,42.12 | IC1.8 95.08,39.56 arc28 94.94,40.16 94.01,41.89 arc82 92.94,42.65
N$7
  Top 1.27: PAD1.1 4.28,71.43 4.28,72.7 5.55,72.7 5.55,70.48 3.64,70.48 3.64,73.66 6.5,73.66 6.5,69.21 2.69,69.21 2.69,74.61 7.77,74.61
  Top 1.778: Q1.D 10.95,57.35 arc45 10.42,58.62 7.77,61.27 D1.A
  Top 2.184: 7.77,74.61 7.77,68.26 1.74,68.26 1.74,74.92 7.77,74.92
  Top 2.54: D1.A 3.33,69.42 arc-45 3.85,70.69 PAD1.1
  pour Top (isolate 0.813): 1.1,62.54 11.9,62.54 11.9,52.38 10,52.7 10,56.83 1.1,56.83
N$8
  Bottom 0.406: IC1.9 86.51,28.25 82.68,32.09 arc-45 82.39,32.79 82.39,39.74 arc-49 82.82,40.7 N1.3
N$9
  Top 0.406: IC6.16 76.03,49.94 arc45 76.33,49.23 77.33,48.23 arc45 78.04,47.94 82.92,47.94 arc45 83.63,48.23 84.95,49.55 arc-45 85.66,49.84 BAT+.1
  Bottom 1.27: TP1.TP 87.78,49.84 BAT+.1
  Bottom 2.54: 87.78,49.84 87.78,51.51 | TP1.TP 87.78,47.62
N$10
  pour Top (isolate 0.61): 66.83,49.21 99.85,49.21 99.85,79.37 66.83,79.37
N$11
  Bottom 0.406: IC1.13 85.88,18.09 85.56,18.41 85.56,25.98 arc-90 86.56,26.98 88.37,26.98 arc90 89.37,27.98 89.37,28.84 arc90 88.37,29.84 87.34,29.84 arc-45 85.93,30.43 84.44,31.92 arc-45 83.85,33.33 N1.4
N$12
  Bottom 0.406: N1.5 86,38.04 arc-45 86.9,38.41 90.97,38.41 arc-34 91.53,38.24 91.78,38.07 arc-56 92.23,37.24 92.23,36.92 arc-45 91.94,36.22 91.89,36.16 arc45 91.59,35.46 91.59,19.46 arc-45 91.3,18.75 88.1,15.55 IC1.14
N$13
  Bottom 0.406: IC1.11 88.73,23.17 90.66,25.1 arc45 90.96,25.81 90.96,34.75 arc26 90.83,35.31 90.32,36.35 90.06,36.74 arc56 89.01,37.3 88.79,37.3 arc33 88.11,37.1 88,37.04 N1.6
N$14
  Bottom 0.406: IC1.10 89.24,25.71 arc90 90.16,26.71 90.16,34.08 arc45 89.58,35.5 N1.7
N$15
  Bottom 0.406: N1.8 92.81,38.68 arc-45 93.18,37.78 93.18,36.16 arc-45 92.81,35.26 92.68,35.13 arc45 92.31,34.23 92.31,12.71 arc45 92.6,12.01 94.13,10.47 IC1.1
N$16
  Bottom 0.406: IC1.2 93.28,13.01 arc-45 93.18,13.25 93.18,33.44 arc-45 93.55,34.34 93.76,34.55 arc45 94.13,35.45 94.13,39.33 arc45 93.76,40.22 N1.9
N$17
  Bottom 0.406: IC3.16 71.27,8.57 70.95,8.57 68.84,10.68 arc-45 68.1,12.48 68.1,23.14 arc45 67.51,24.55 57.65,34.57 arc-45 57.06,35.99 57.06,42.27 arc-45 57.65,43.68 59.26,45.13 arc-45 60.67,45.72 62.19,45.72 arc-45 63.6,45.13 64.79,43.95 arc45 66.14,43.38 66.19,43.33 67.67,43.33 N2.0
N$18
  Bottom 0.406: IC3.15 69.48,13.54 arc-45 68.73,15.34 68.73,23.77 arc45 68.15,25.19 58.44,34.97 arc-45 57.86,36.38 57.86,41.95 arc-45 58.52,43.44 59.26,44.18 arc-45 60.67,44.76 61.84,44.76 N2.1
N$19
  Bottom 0.406: N2.2 60.97,42.64 arc45 62.74,41.91 66.36,41.91 arc21 67.26,42.07 68.12,42.4 arc-66 69.47,42.12 77.35,34.24 78.84,32.75 arc-45 79.21,31.85 IC3.8
N$20
  Bottom 0.406: IC3.9 68.61,26.66 arc-45 67.19,27.25 59.16,35.29 arc-45 58.57,36.7 58.57,39.87 arc-45 58.89,40.63 59.47,41.22 N2.3
N$21
  Top 0.406: R6.1 60.97,24.44 T13.B
N$22
  Bottom 0.406: IC3.13 70.69,16.5 arc-90 69.69,17.5 69.69,24.39 arc-90 70.69,25.39 72.5,25.39 arc90 73.5,26.39 73.5,27.25 arc90 72.5,28.25 68.13,28.25 arc-45 66.72,28.84 60.11,35.45 arc-45 59.52,36.86 59.52,38.94 N2.4
N$23
  Bottom 0.406: IC3.14 72.86,13.96 75.5,16.61 arc45 75.8,17.32 75.8,29.25 arc45 75.21,30.66 68.41,37.46 67.23,38.35 arc37 67.04,38.41 62.66,38.41 arc45 61.95,38.12 61.93,38.09 61.91,38.09 60.97,37.16 N2.5
N$24
  Bottom 0.305: 66.51,35.87 65.56,37.3
  Bottom 0.406: IC3.11 74.08,21.59 arc90 75.08,22.59 75.08,28.69 arc45 74.5,30.11 72.49,32.11 arc45 71.08,32.7 70.51,32.7 arc-45 69.1,33.28 66.51,35.87 | N2.6 63.34,36.5 63.34,36.51 64.19,37.37 arc-45 64.42,37.46 65.16,37.46 arc-27 65.31,37.43 65.56,37.3
N$25
  Top 2.54: B1.+ 44.12,75.24 L1.B1
N$26
  Bottom 0.406: IC3.10 73.21,24.12 arc90 74.21,25.12 74.21,28.3 arc45 73.62,29.71 72.18,31.16 arc45 70.76,31.75 70.19,31.75 arc-45 68.77,32.33 65.56,35.55 N2.7
N$27
  Bottom 0.406: IC3.1 78.26,8.88 76.8,10.34 arc-45 76.51,11.04 76.51,30.74 arc45 76.14,31.64 68.73,39.05 68.43,39.05 arc-45 N2.8
N$28
  Bottom 0.406: IC3.2 77.6,13.04 arc-45 77.3,13.74 77.3,31.87 arc45 76.72,33.28 68.62,41.38 N2.9
N$29
  Bottom 0.406: IC4.16 27.46,8.88 25.19,11.16 arc-45 24.6,12.57 24.6,38.52 arc-45 24.97,39.42 31.21,45.66 arc-45 32.11,46.03 33.93,46.03 arc-45 35.35,45.45 37.17,43.62 arc45 38.25,43.17 39.57,43.17 N3.0
N$30
  Bottom 0.406: IC4.15 27.46,11.43 26.14,12.74 arc-45 25.55,14.16 25.55,38.2 arc-45 25.92,39.1 31,44.18 arc-45 32.41,44.76 33.81,44.76 33.94,44.63 N3.1
N$31
  Bottom 0.406: IC4.8 35.71,27.94 42.43,34.65 arc45 43.02,36.07 43.02,39.81 arc45 42.43,41.22 41.55,42.1 arc68 40.17,42.37 39.61,42.14 arc-27 38.44,41.96 34.24,42.3 arc-40 32.68,43.03 32.33,43.38 N3.2
N$32
  Bottom 0.406: N3.3 31.38,41.38 28.46,38.47 arc45 28.09,37.57 IC4.9
N$33
  Top 0.813: L1.A1 42.38,67.15
  Top 1.27: 42.38,67.15 42.38,68.58
  Top 2.54: B1.- 43.97,70.16 42.38,68.58
N$34
  Bottom 0.406: IC4.13 27.14,16.5 26.77,16.87 arc-45 26.19,18.29 26.19,24.76 26.82,25.39 29.36,25.39 30,26.03 30,37.01 arc-45 30.31,37.78 31.67,39.13 N3.4
N$35
  Bottom 0.406: N3.5 33.03,37.32 33.69,37.97 arc-45 34.75,38.41 39,38.41 arc-45 39.89,38.04 arc-90 39.89,35.92 32.81,28.84 arc45 32.22,27.42 32.22,24 arc-45 31.63,22.59 31.54,22.49 arc45 30.95,21.07 30.95,16.06 arc-45 30.36,14.65 30.27,14.55 arc-45 28.85,13.96 IC4.14
N$36
  Bottom 0.406: N3.6 35.99,37.02 arc-45 36.81,37.38 arc-45 37.53,37.23 37.75,37.01 arc-90 37.91,35.13 32.17,29.47 arc45 31.58,28.06 31.58,24.64 arc-45 31,23.22 29.36,21.59 IC4.11
N$37
  Bottom 0.406: IC4.10 29.68,24.12 30.36,24.81 arc45 30.79,26.14 30.79,28.54 arc-45 31.38,29.95 37.03,35.6 N3.7
N$38
  Bottom 0.406: IC4.1 35.27,8.88 arc-45 33.86,9.47 33.6,9.73 arc-45 33.01,11.14 33.01,26.79 arc-45 33.44,28.2 40.52,35.29 arc45 41.11,36.7 41.11,37.96 arc45 40.79,38.73 40.39,39.13 N3.8
N$39
  Bottom 0.406: N3.9 40.68,41.38 41.48,40.59 arc-45 42.06,39.17 42.06,36.38 arc-45 41.48,34.97 33.81,27.3 33.81,12.06 34.44,11.43 IC4.2 36.35,11.43
N$40
  Bottom 0.406: N4.0 16.13,43.38 18.51,41.01 arc-45 18.88,40.11 18.88,36.4 arc-45 18.51,35.5 15.17,32.16 arc45 14.44,30.39 14.44,13.33 15.08,12.7 17.61,12.7 18.25,12.06 18.25,8.25 17.61,7.61 10,7.61 IC5.16
N$41
  Bottom 0.406: N4.1 8.38,44.63 7.46,44.45 6.82,44.02 arc33 6.35,43.46 5.63,41.78 arc23 5.55,41.38 5.55,13.65 7.77,11.43 IC5.15
N$42
  Bottom 0.406: IC5.8 16.34,31.03 arc-45 17.08,32.8 19.46,35.18 arc45 19.84,36.08 19.84,40.43 arc45 19.46,41.32 16.47,44.32 arc94 15.01,44.26 14.65,43.84 arc-55 12.52,42.98 N4.2
N$44
  Bottom 0.406: IC5.9 8.73,27.85 arc45 7.99,29.62 7.23,30.38 arc-45 6.5,32.15 6.5,39.66 arc-45 7.09,41.07 N4.3
N$45
  Bottom 0.406: IC5.13 8.09,16.5 7.55,17.04 arc-45 6.82,18.81 6.82,24.76 7.46,25.39 10,25.39 10.63,26.03 10.63,27.22 arc45 9.9,28.98 8.19,30.7 arc-45 7.46,32.46 7.46,38.94 N4.4
N$46
  Bottom 0.406: IC5.14 10,13.96 12.54,16.5 12.54,31.98 arc-45 13.27,33.75 15.74,36.22 arc45 16.03,36.92 16.03,37.28 arc53 15.63,38.08 15.02,38.53 arc37 14.42,38.73 11.32,38.73 arc45 9.91,38.14 N4.5
N$47
  Bottom 0.406: N4.6 10.9,36.46 11.61,37.17 arc-45 12.31,37.46 12.67,37.46 arc-55 13.71,36.92 13.83,36.74 arc-80 13.69,35.12 12.63,34.06 arc45 11.9,32.3 11.9,23.81 9.68,21.59 IC5.11
N$48
  Bottom 0.406: IC5.10 10,24.12 11.27,25.39 11.27,33.47 arc-45 12,35.23 N4.7
N$49
  Bottom 0.406: 16.26,39.13 N4.8 16.48,38.78 arc-43 16.82,37.91 16.82,36.93 arc-36 16.57,36.17 16.37,35.9 13.9,33.43 arc45 13.17,31.66 13.17,10.47 14.76,8.88 IC5.1
N$50
  Bottom 0.406: IC5.2 14.76,11.43 13.81,12.38 13.81,31.03 arc-45 14.54,32.8 17.56,35.82 arc45 17.93,36.72 17.93,39.33 arc45 17.56,40.22 N4.9
N$51
  Top 0.406: T13.C 62.06,26.98 DOT1.1
N$53
  Top 0.406: C14.1 77.3,63.57
  Top 0.61: 77.3,63.57 IC6.4 | C14.1 71.59,63.81 70.95,64.45 L2.2
N$56
  Top 0.406: IC2.43 57.96,20.98 58.57,21.59 59.3,21.59 R12.R1$1
N$63
  Top 0.406: IC2.42 58.12,20.18 58.57,20.63 59.26,20.63 R12.R2$1
N$64
  Bottom 2.54: B1.AC2 59.84,75.24 J2.3 J2.2
N$65
  Top 2.54: J2.1 52.22,67.46 B1.AC1
N$66
  Top 0.406: IC2.41 58.27,19.38 58.89,20 59.26,20 R12.R3$1
N$67
  Top 0.406: IC2.40 58.42,18.57 58.89,19.05 59.27,19.05 R12.R4$1
N$68
  Top 0.406: IC2.26 49.67,9.73 R13.R1$1
N$69
  Top 0.406: IC2.25 48.87,9.76 R13.R2$1
N$70
  Top 0.406: IC2.24 48.07,9.76 R13.R3$1
N$71
  Top 0.406: IC2.23 47.27,9.76 R13.R4$1
N$72
  Top 0.406: IC2.22 43.29,13.78 R14.R1$1
N$73
  Top 0.406: IC2.21 43.26,14.58 R14.R2$1
N$74
  Top 0.406: IC2.20 43.26,15.38 R14.R3$1
N$75
  Top 0.406: IC2.19 43.26,16.18 R14.R4$1
N$76
  Top 0.406: IC2.34 59.25,13.78 R8.R1$2
N$77
  Top 0.406: IC2.35 59.25,14.58 R8.R2$2
N$78
  Top 0.406: IC2.36 59.25,15.38 R8.R3$2
N$79
  Top 0.406: IC2.37 59.25,16.18 R8.R4$2
RESET#
  Top 0.305: R15.1 84.36,61.91 | SW1.P$2 94.45,60.95 94.77,61.27
  Top 0.406: IC2.4 52.87,46.26 arc-45 53.61,48.06 60.21,54.65 arc-45 61.62,55.24 68.1,55.24 70.95,58.1 74.77,58.1 | SL3.5 94.77,61.27 94.77,61.91 84.36,61.91 | R15.1 84.22,61.91 82.7,61.91 82.07,61.27 82.07,58.73 81.43,58.1 74.77,58.1 | 74.77,58.1 IC6.6
RTCINT
  Top 0.406: IC2.11 47.14,23.7 47.14,24.12 46.93,24.33 arc-45 46.19,26.13 46.19,30.69 arc-45 46.93,32.49 51.48,37.03 arc45 52.22,38.83 52.22,46.88 arc-45 52.97,48.68 59.89,55.61 arc-45 61.31,56.19 65.91,56.19 arc90 68.41,58.69 68.41,61.91 arc-90 69.05,62.54 75.4,62.54 arc-90 76.03,61.91 IC6.5
RTCSEL#
  Top 0.305: 81.11,61.59 IC6.1
  Top 0.406: 81.11,61.59 83.56,64.03 arc-45 85.33,64.77 89.61,64.77 arc45 91.37,65.5 92.45,66.57 arc45 93.18,68.34 93.18,74.01 arc90 90.68,76.51 68.06,76.51 arc90 65.56,74.01 65.56,61.55 arc-90 63.06,59.05 60.35,59.05 arc45 58.94,58.46 51.06,50.59 arc45 50.32,48.79 50.32,40.73 arc-45 49.57,38.94 43.76,33.12 arc45 43.02,31.33 43.02,20.63 44.27,19.38 IC2.15
RXD
  Top 0.406: IC2.9 48.87,26.8 49.37,27.3 COMRXD.1
SCK
  Top 0.406: IC2.3 53.67,45.79 arc-45 54.41,47.59 60.53,53.7 arc-45 61.94,54.29 68.73,54.29 69.37,54.92 79.53,54.92 81.11,53.34 81.11,53.02 | 81.11,53.02 IC6.20 | SL3.4 92.23,54.34 arc-90 91.23,53.34 81.43,53.34 81.11,53.02
TXD
  Top 0.406: IC2.10 48.07,27.64 COMTXD.1

### Text on the board
Top: PATASHNIK
SMD1: 2009